# EAGLE design batteryCharger (EAGLE 7.7.0)

## Sheet 1 of 4
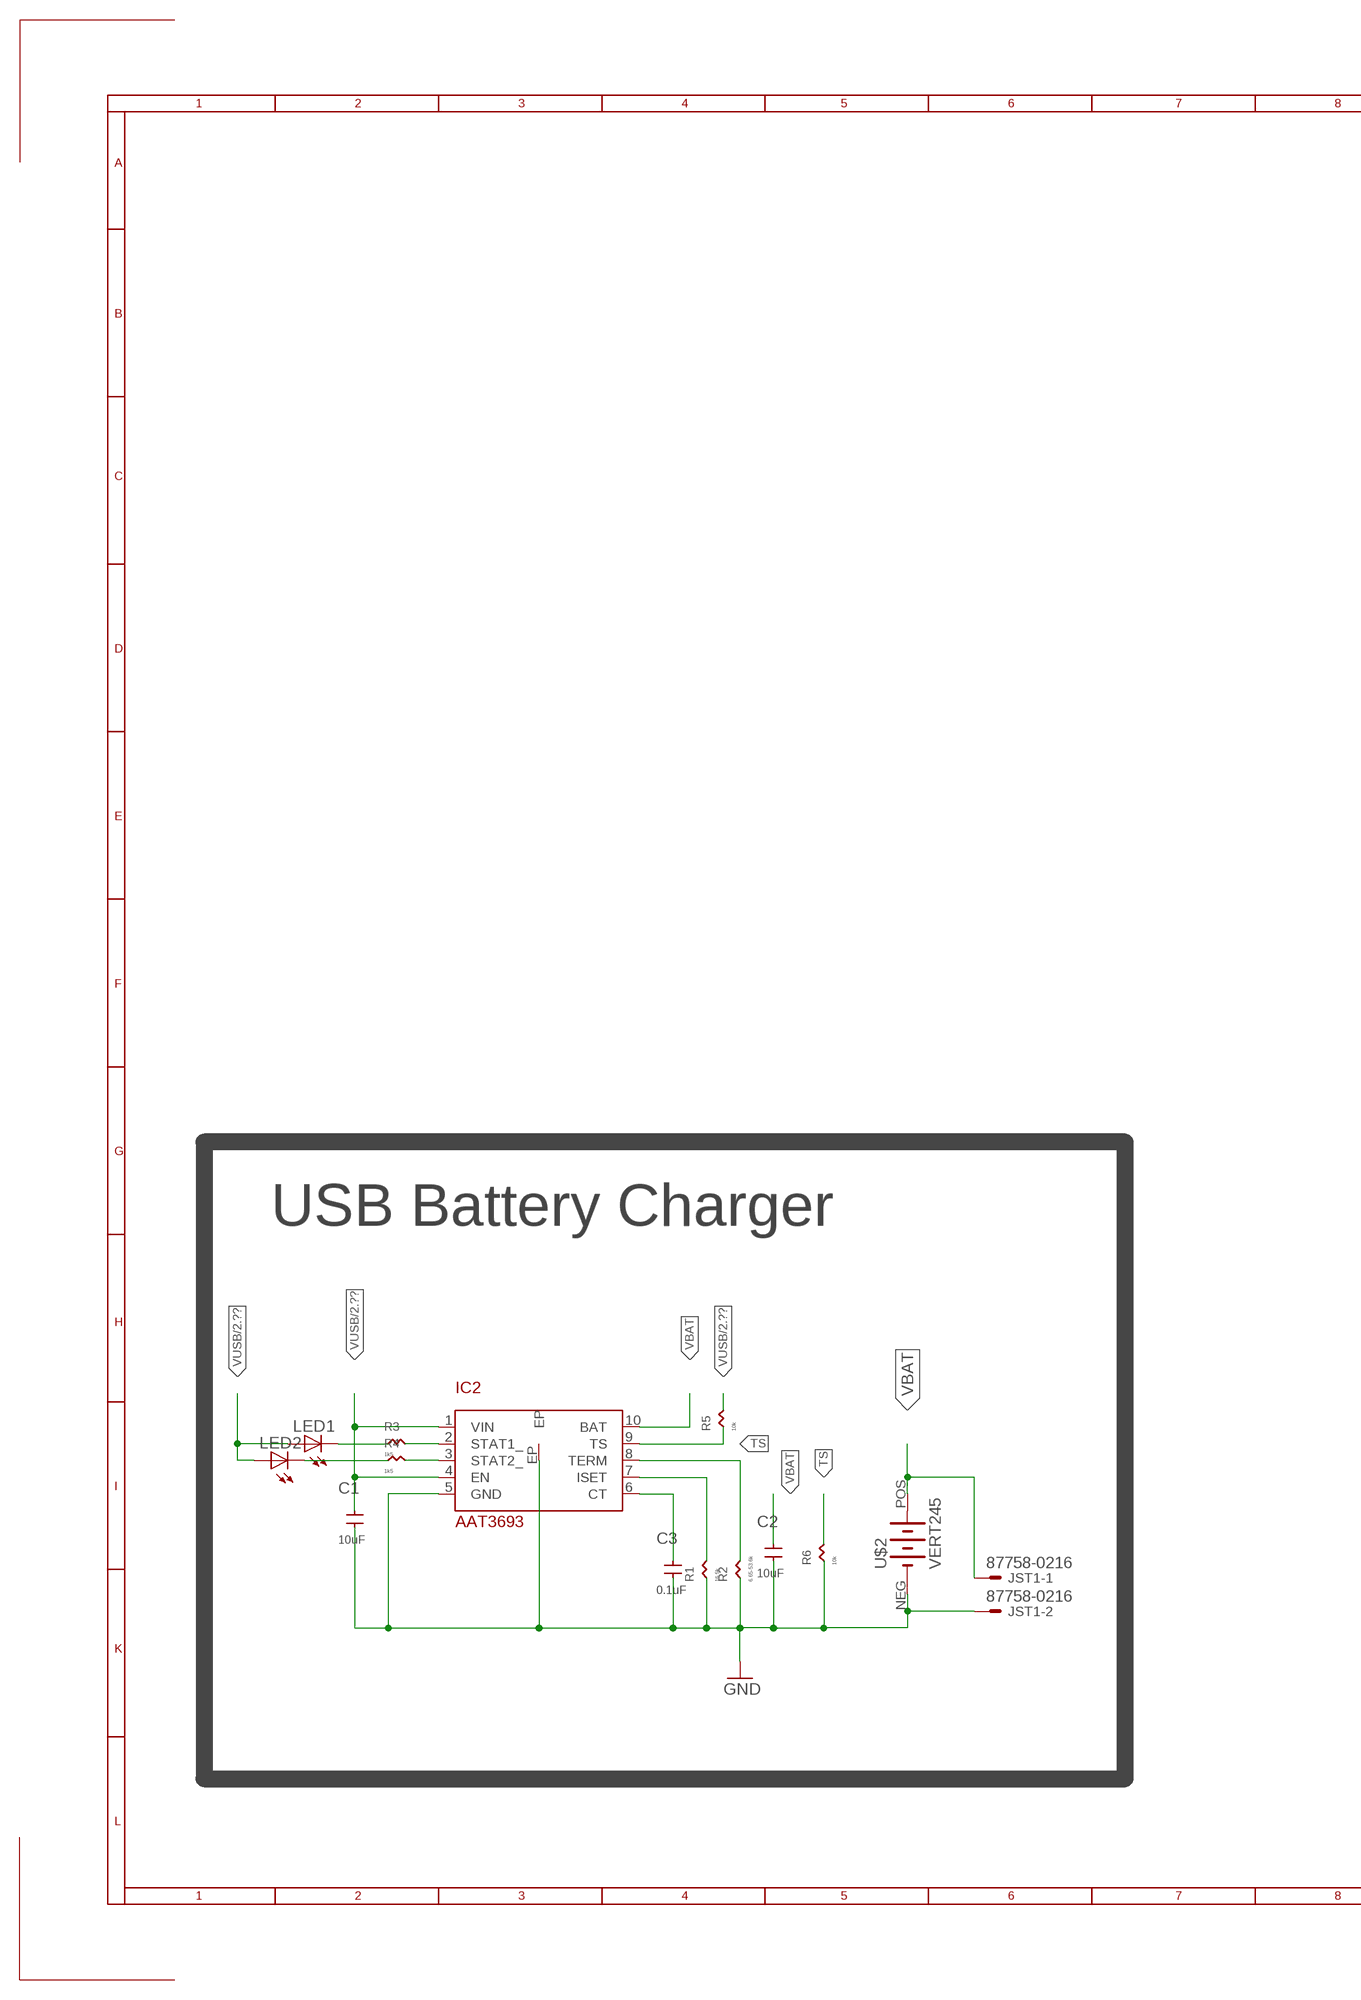
[diagram p0: schematic, sheet 1, part 1 of 2]
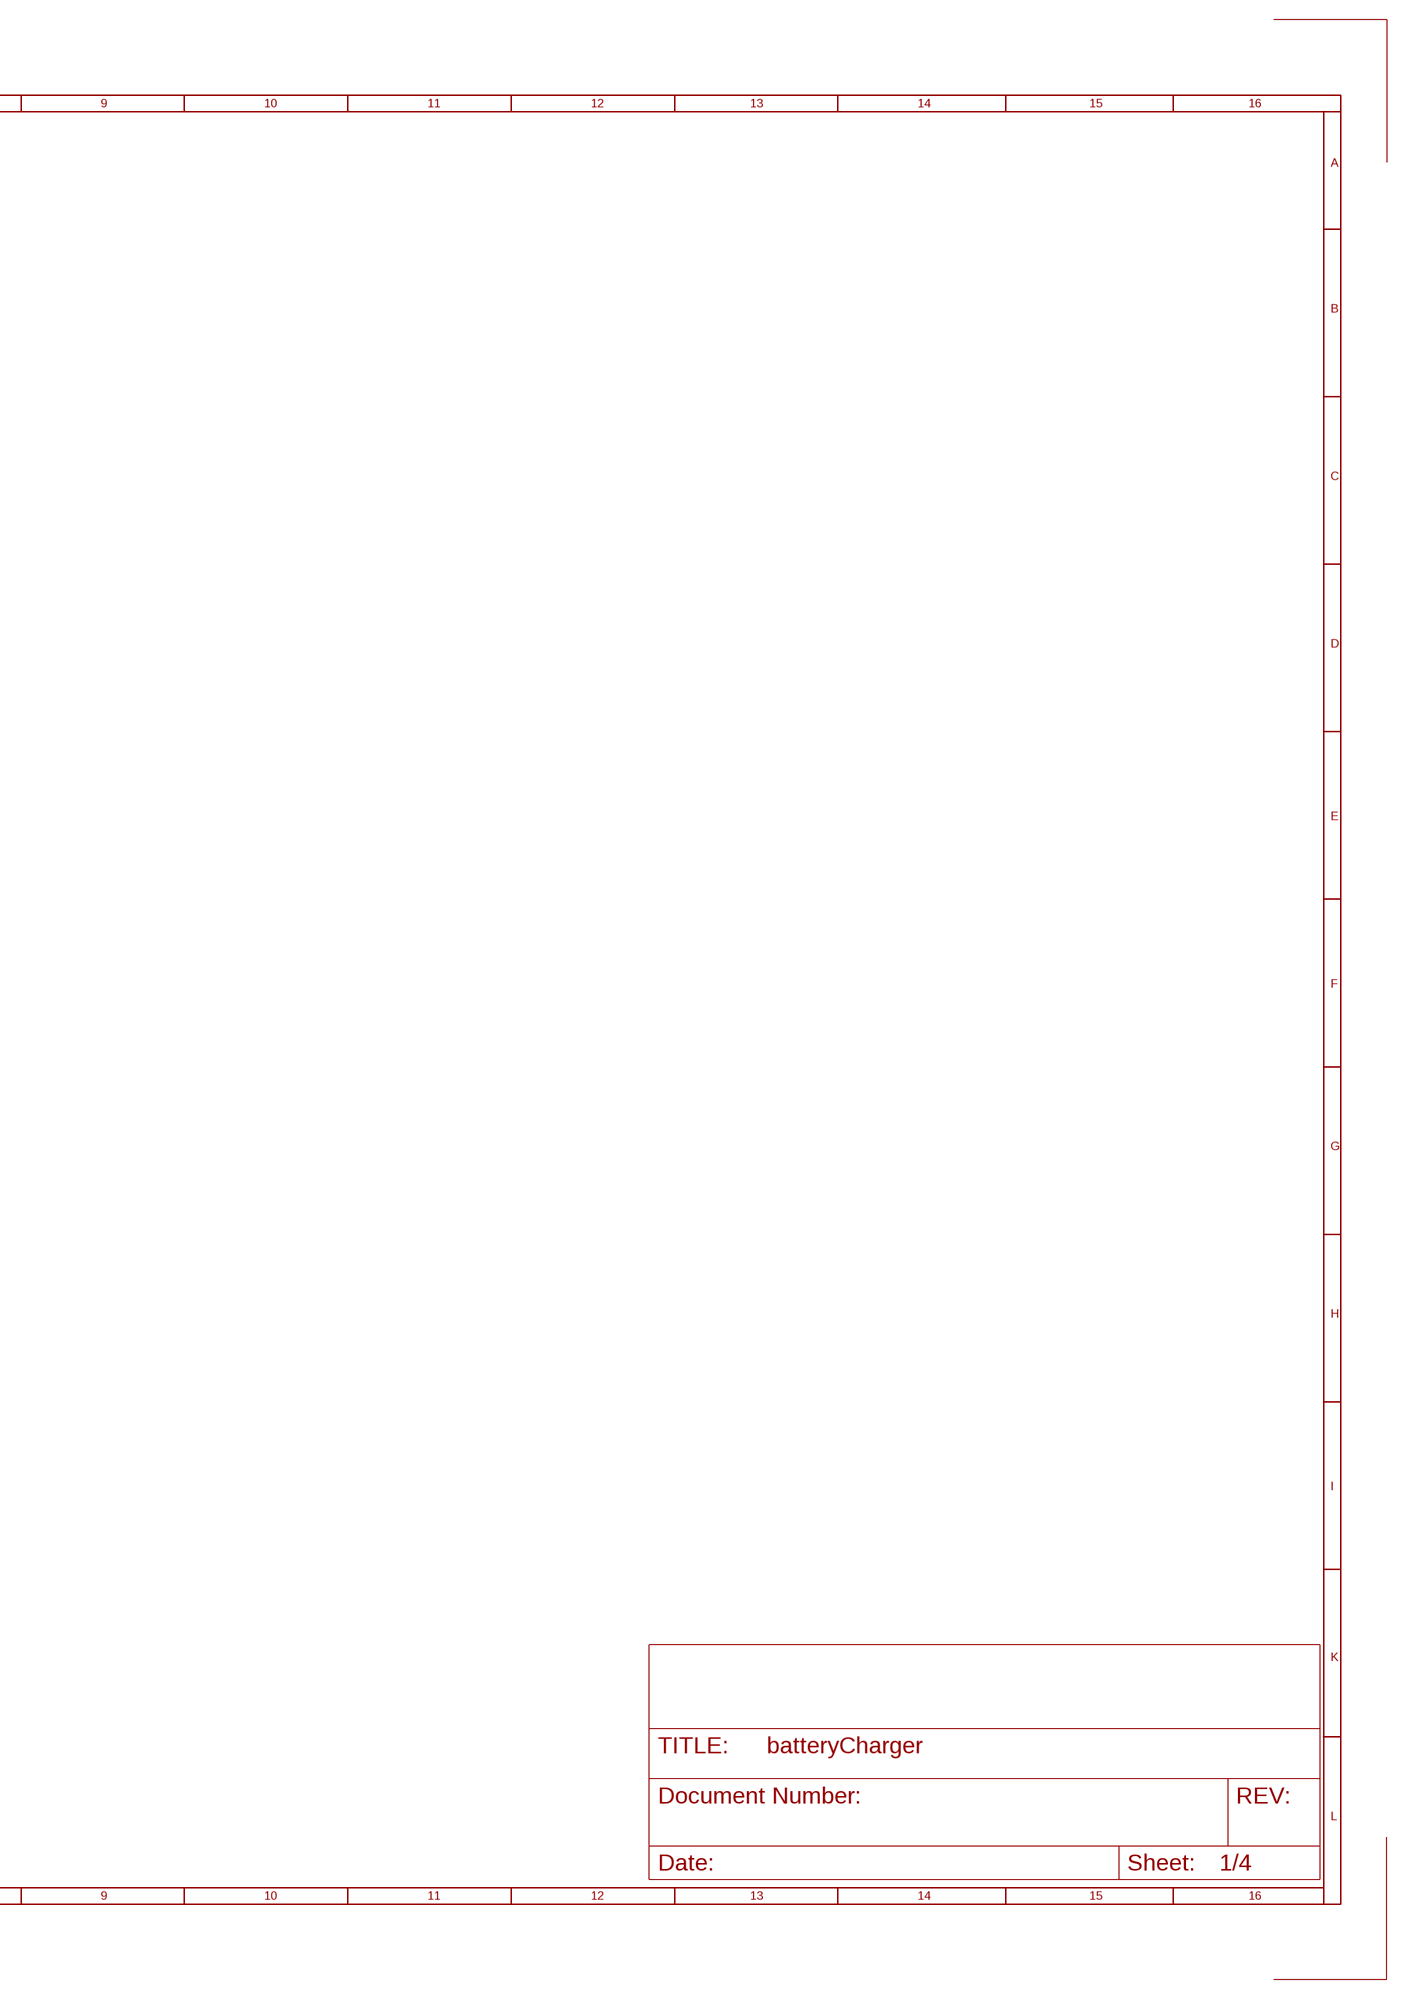
[diagram p1: schematic, sheet 1, part 2 of 2]

### Parts
C1  10uF  C-ER  [C0805]
C2  10uF  C-ER  [C0805]
C3  0.1uF  C-ERC0402  [C0402]
IC2  AAT3693  [AAT3693]
JST1  87758-0216  [87758-0216]
LED1  LEDCHIP-LED0603  [CHIP-LED0603]
LED2  LEDCHIP-LED0603  [CHIP-LED0603]
R1  16.5k  R-ER-TINYR402  [R0402]
R2  6.65-53.6k  R-ER-TINYR402  [R0402]
R3  1k5  R-ER-TINYR402  [R0402]
R4  1k5  R-ER-TINYR402  [R0402]
R5  10k  R-ER-TINYR402  [R0402]
R6  10k  R-ER-TINYR402  [R0402]
U$2  VERT245  [VERT245]

### Nets
GND: C1.1 C2.1 C3.1 IC2.5(GND) IC2.EP JST1.2 R1.1 R2.1 R6.1 U$2.NEG(-) ; also sheet 2,3,4
N$17: C3.2 IC2.6(CT)
N$18: IC2.7(ISET) R1.2
N$19: IC2.8(TERM) R2.2
N$20: IC2.3(STAT2_) R4.2
N$21: IC2.2(STAT1_) R3.2
N$22: LED1.C R3.1
N$23: LED2.C R4.1
TS: IC2.9(TS) R5.1 R6.2
VBAT: C2.2 IC2.10(BAT) JST1.1 U$2.POS(+)
VUSB: C1.2 IC2.1(VIN) IC2.4(EN) LED1.A LED2.A R5.2 ; also sheet 2,3,4

### Notes on the sheet
- USB Battery Charger

## Sheet 2 of 4
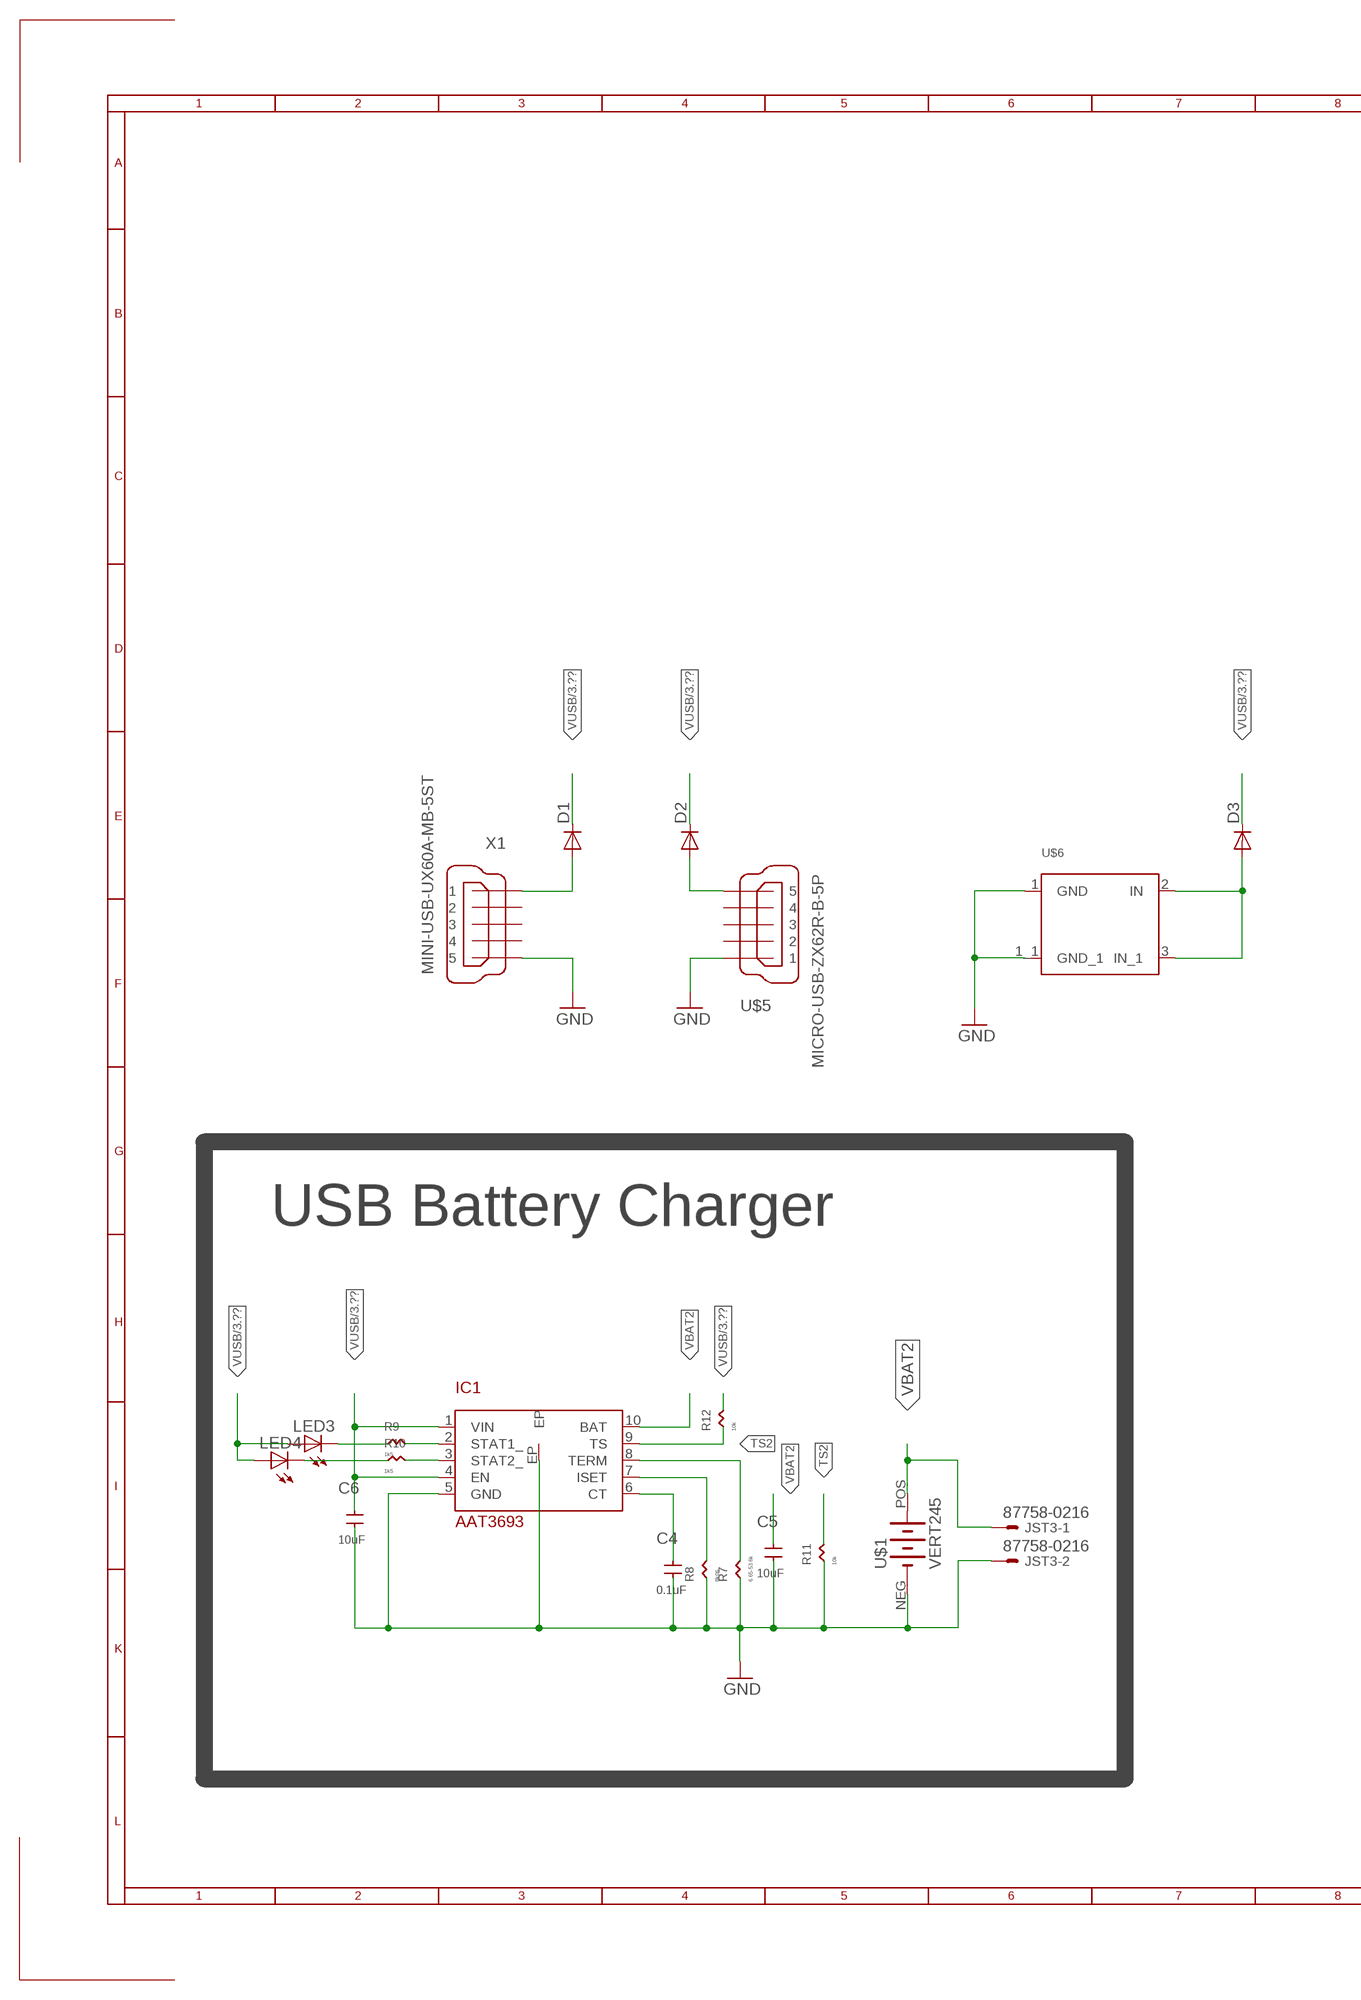
[diagram p2: schematic, sheet 2, part 1 of 2]
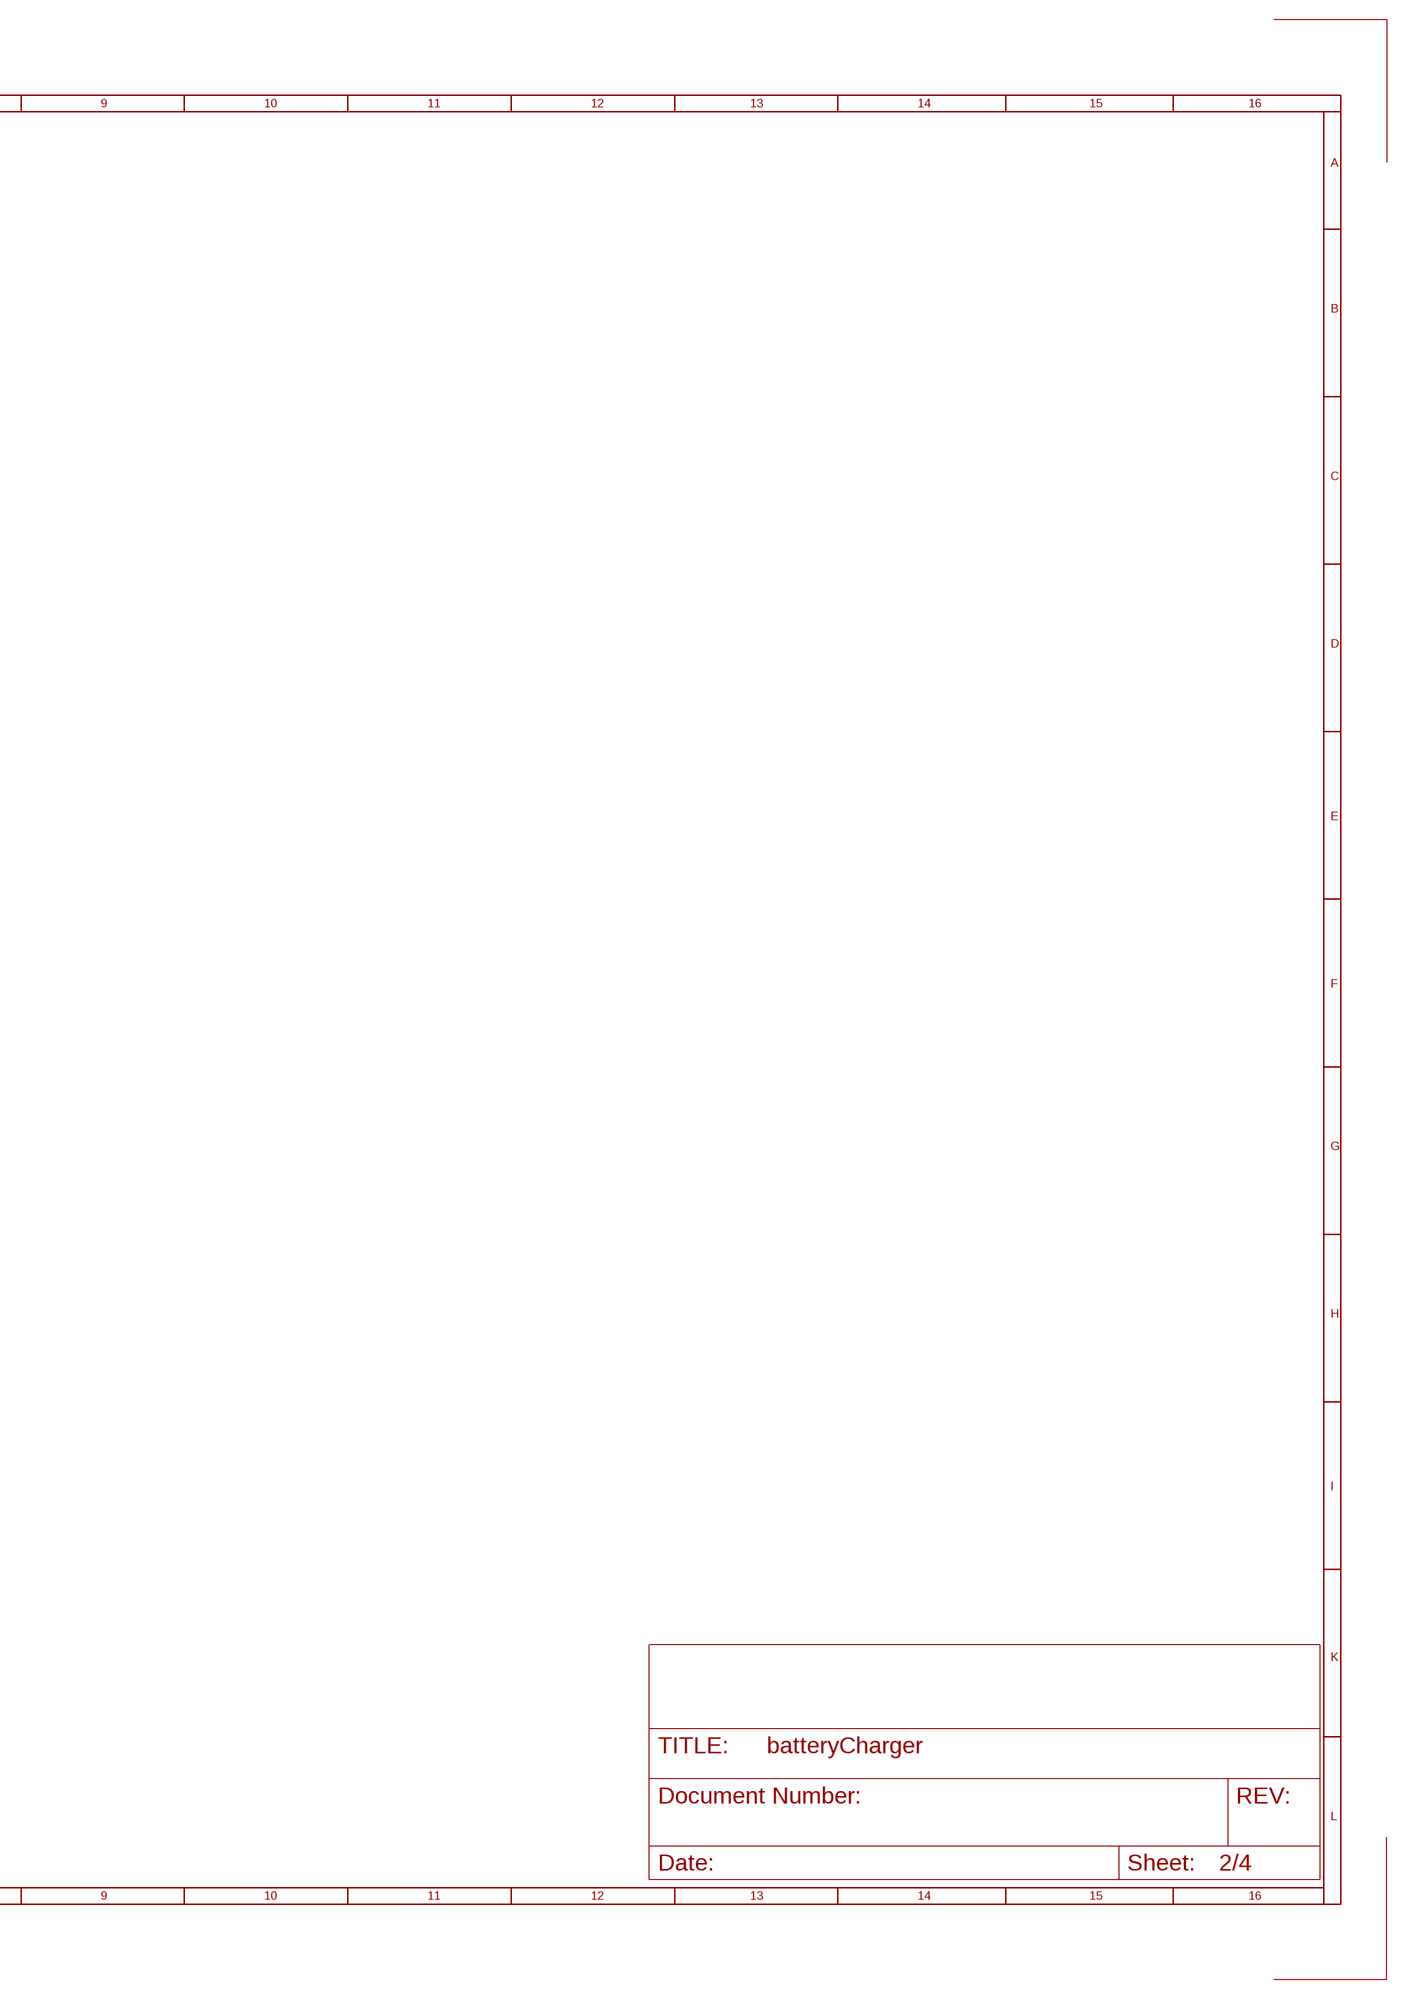
[diagram p3: schematic, sheet 2, part 2 of 2]

### Parts
C4  0.1uF  C-ERC0402  [C0402]
C5  10uF  C-ER  [C0805]
C6  10uF  C-ER  [C0805]
D1  DIODE-SOD323-R  [SOD323-R]
D2  DIODE-SOD323-R  [SOD323-R]
D3  DIODE-SOD323-R  [SOD323-R]
IC1  AAT3693  [AAT3693]
JST3  87758-0216  [87758-0216]
LED3  LEDCHIP-LED0603  [CHIP-LED0603]
LED4  LEDCHIP-LED0603  [CHIP-LED0603]
R7  6.65-53.6k  R-ER-TINYR402  [R0402]
R8  8k06  R-ER-TINYR402  [R0402]
R9  1k5  R-ER-TINYR402  [R0402]
R10  1k5  R-ER-TINYR402  [R0402]
R11  10k  R-ER-TINYR402  [R0402]
R12  10k  R-ER-TINYR402  [R0402]
U$1  VERT245  [VERT245]
U$5  MICRO-USB-ZX62R-B-5P  [ZX62R-B-5P]
U$6  PJ-002A_SMT  [PJ-002A_SMT]
X1  MINI-USB-UX60A-MB-5ST  [UX60A-MB-5ST]

### Nets
GND: C4.1 C5.1 C6.1 IC1.5(GND) IC1.EP JST3.2 R7.1 R8.1 R11.1 U$1.NEG(-) U$5.1 U$6.1(GND) U$6.1_1(GND_1) X1.5 ; also sheet 1,3,4
N$1: C4.2 IC1.6(CT)
N$2: IC1.7(ISET) R8.2
N$3: IC1.8(TERM) R7.2
N$4: IC1.3(STAT2_) R10.2
N$5: IC1.2(STAT1_) R9.2
N$6: LED3.C R9.1
N$7: LED4.C R10.1
N$29: D1.A X1.1
N$31: D2.A U$5.5
N$32: D3.A U$6.2(IN) U$6.3(IN_1)
TS2: IC1.9(TS) R11.2 R12.1
VBAT2: C5.2 IC1.10(BAT) JST3.1 U$1.POS(+)
VUSB: C6.2 D1.C D2.C D3.C IC1.1(VIN) IC1.4(EN) LED3.A LED4.A R12.2 ; also sheet 1,3,4
Unconnected: U$5.2 U$5.3 U$5.4 U$6.NC U$6.NC_1 X1.2 X1.3 X1.4

### Notes on the sheet
- USB Battery Charger

## Sheet 3 of 4
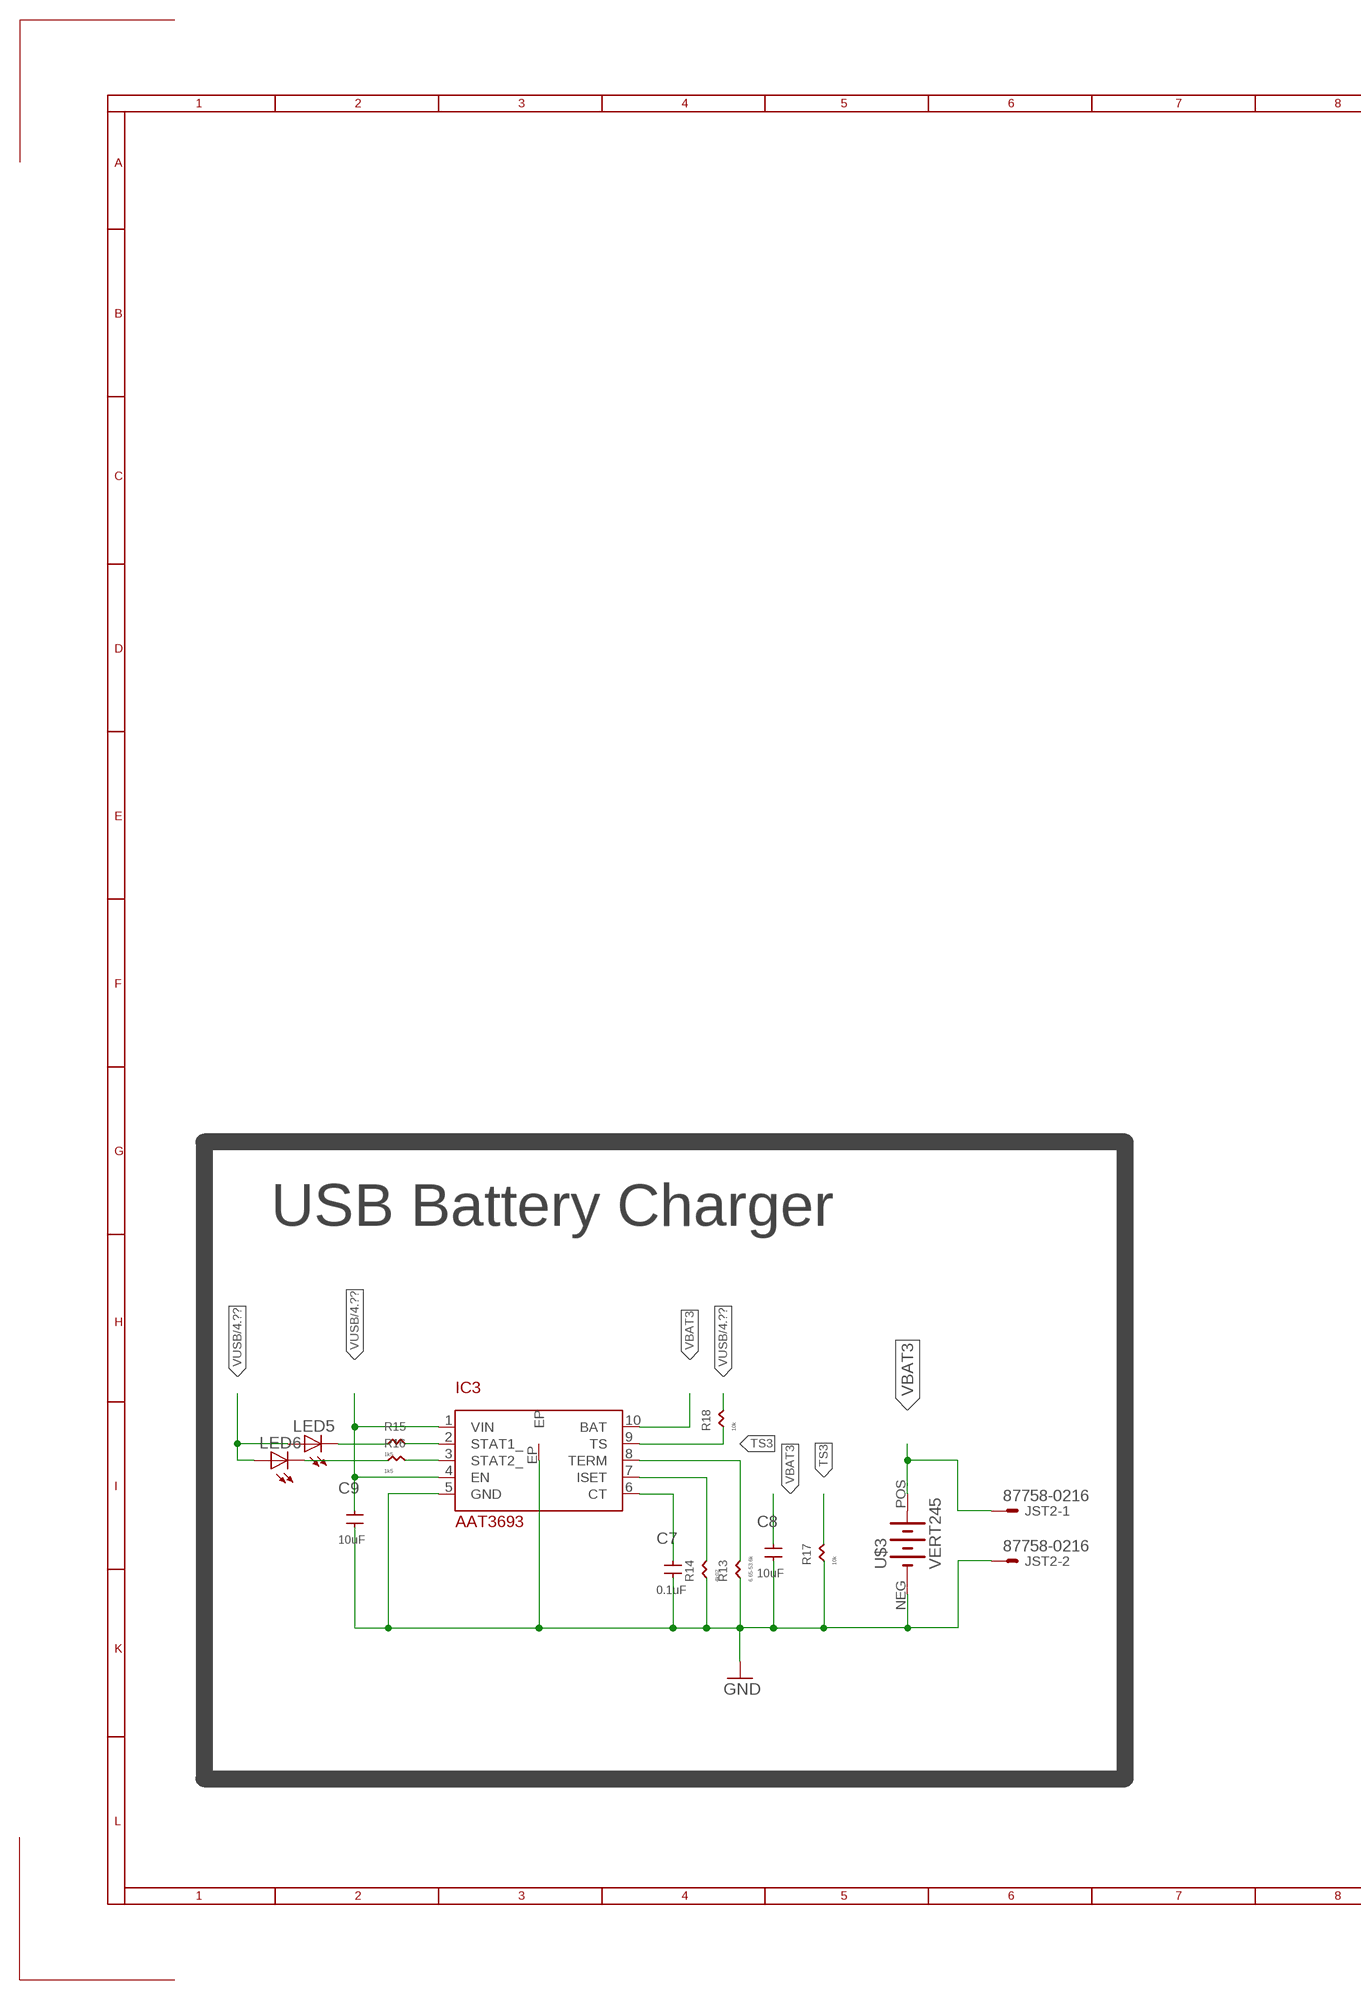
[diagram p4: schematic, sheet 3, part 1 of 2]
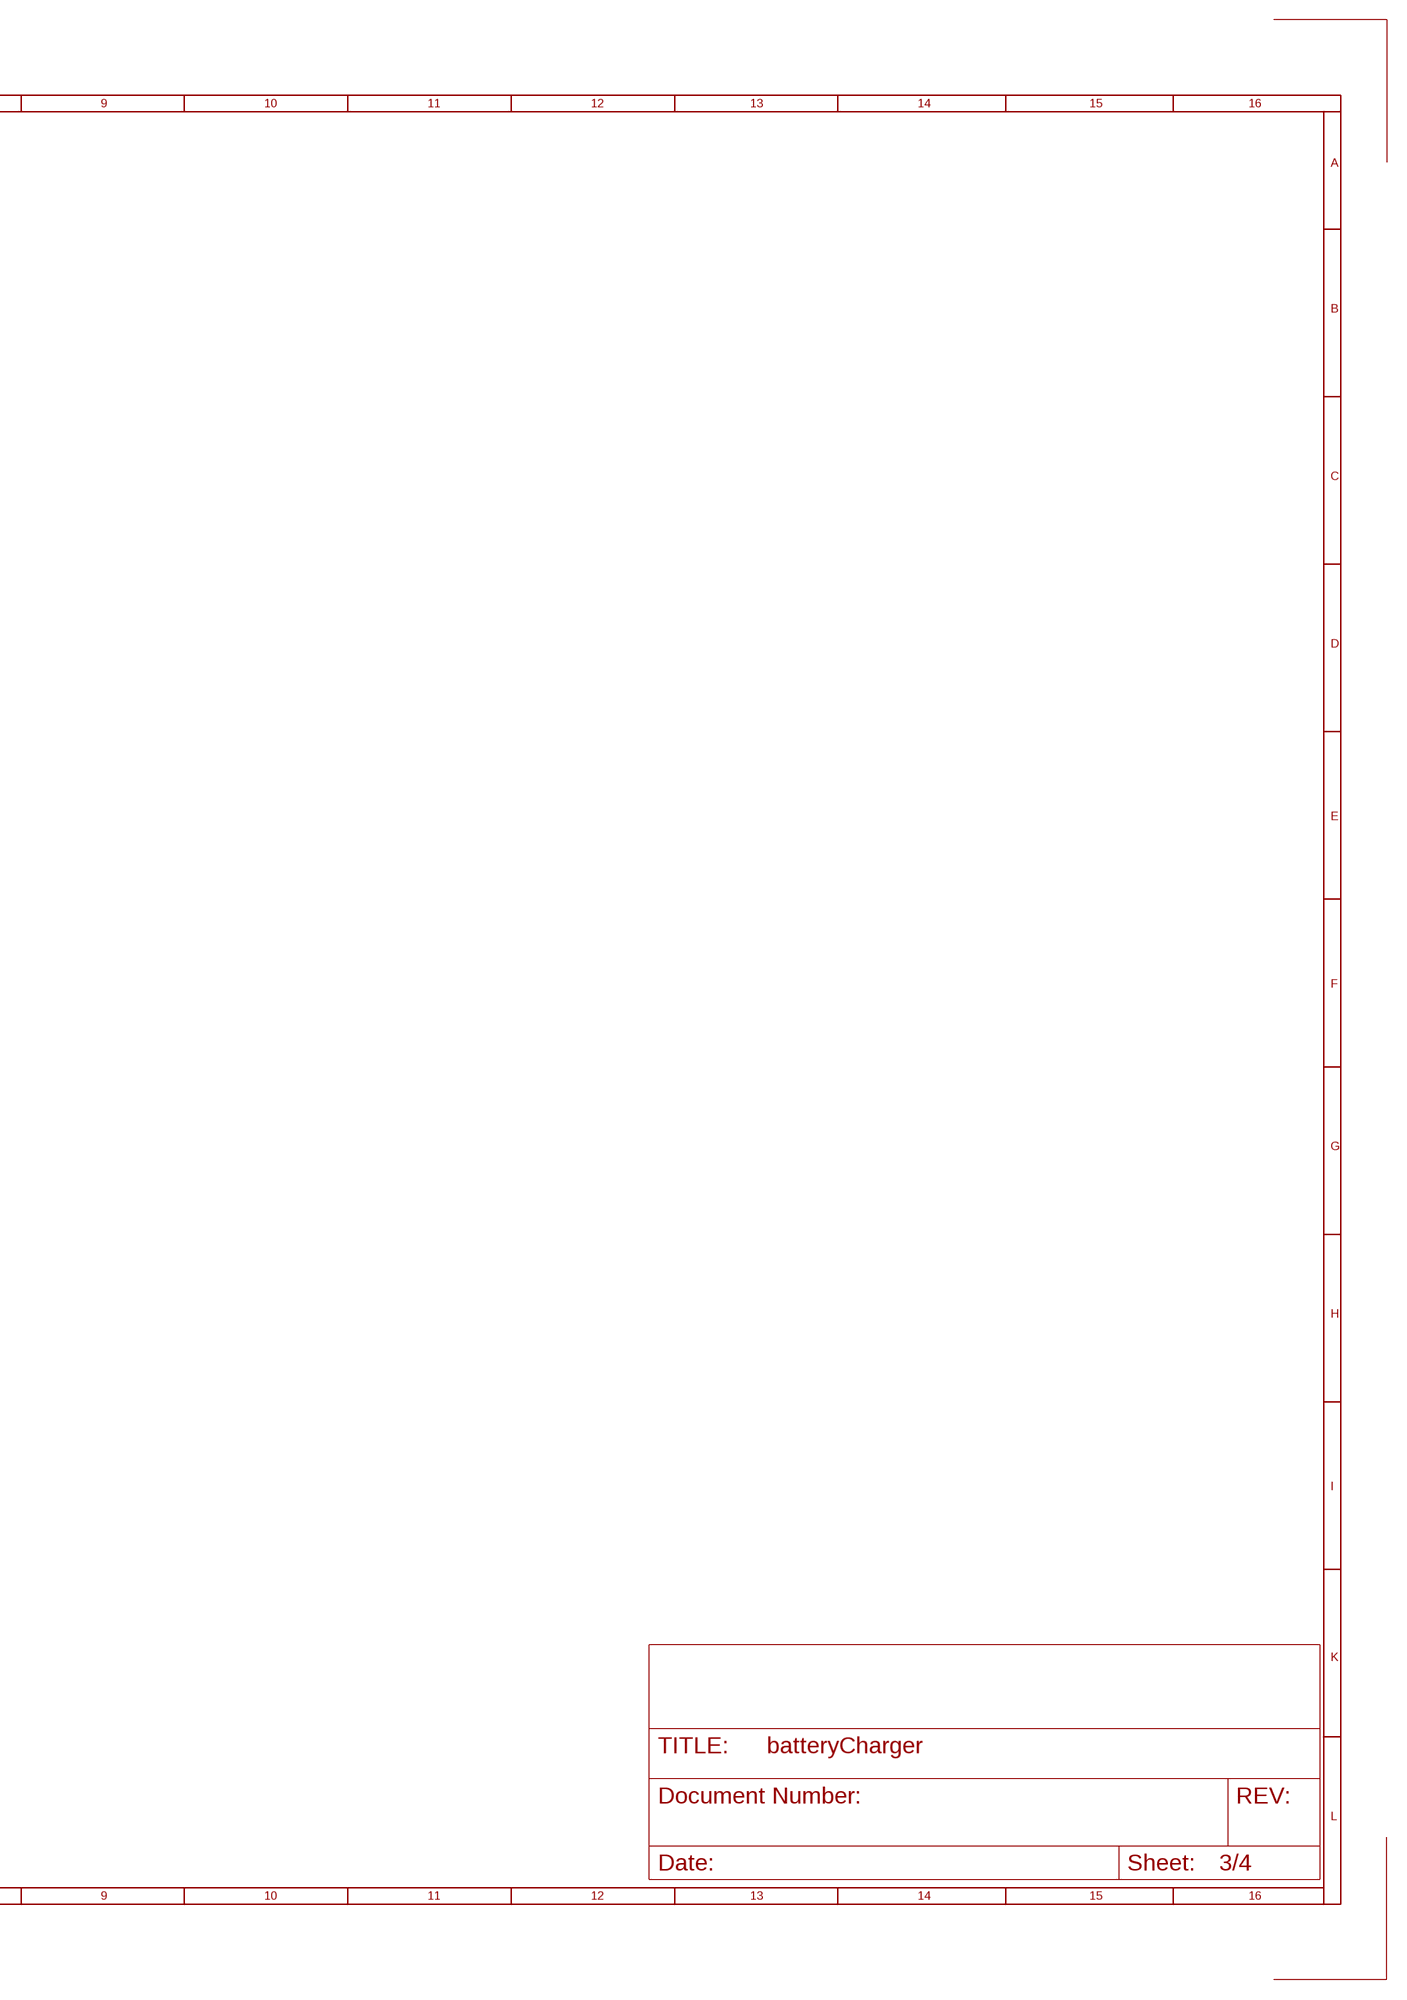
[diagram p5: schematic, sheet 3, part 2 of 2]

### Parts
C7  0.1uF  C-ERC0402  [C0402]
C8  10uF  C-ER  [C0805]
C9  10uF  C-ER  [C0805]
IC3  AAT3693  [AAT3693]
JST2  87758-0216  [87758-0216]
LED5  LEDCHIP-LED0603  [CHIP-LED0603]
LED6  LEDCHIP-LED0603  [CHIP-LED0603]
R13  6.65-53.6k  R-ER-TINYR402  [R0402]
R14  4k02  R-ER-TINYR402  [R0402]
R15  1k5  R-ER-TINYR402  [R0402]
R16  1k5  R-ER-TINYR402  [R0402]
R17  10k  R-ER-TINYR402  [R0402]
R18  10k  R-ER-TINYR402  [R0402]
U$3  VERT245  [VERT245]

### Nets
GND: C7.1 C8.1 C9.1 IC3.5(GND) IC3.EP JST2.2 R13.1 R14.1 R17.1 U$3.NEG(-) ; also sheet 1,2,4
N$8: C7.2 IC3.6(CT)
N$9: IC3.7(ISET) R14.2
N$10: IC3.8(TERM) R13.2
N$11: IC3.3(STAT2_) R16.2
N$12: IC3.2(STAT1_) R15.2
N$13: LED5.C R15.1
N$14: LED6.C R16.1
TS3: IC3.9(TS) R17.2 R18.1
VBAT3: C8.2 IC3.10(BAT) JST2.1 U$3.POS(+)
VUSB: C9.2 IC3.1(VIN) IC3.4(EN) LED5.A LED6.A R18.2 ; also sheet 1,2,4

### Notes on the sheet
- USB Battery Charger

## Sheet 4 of 4
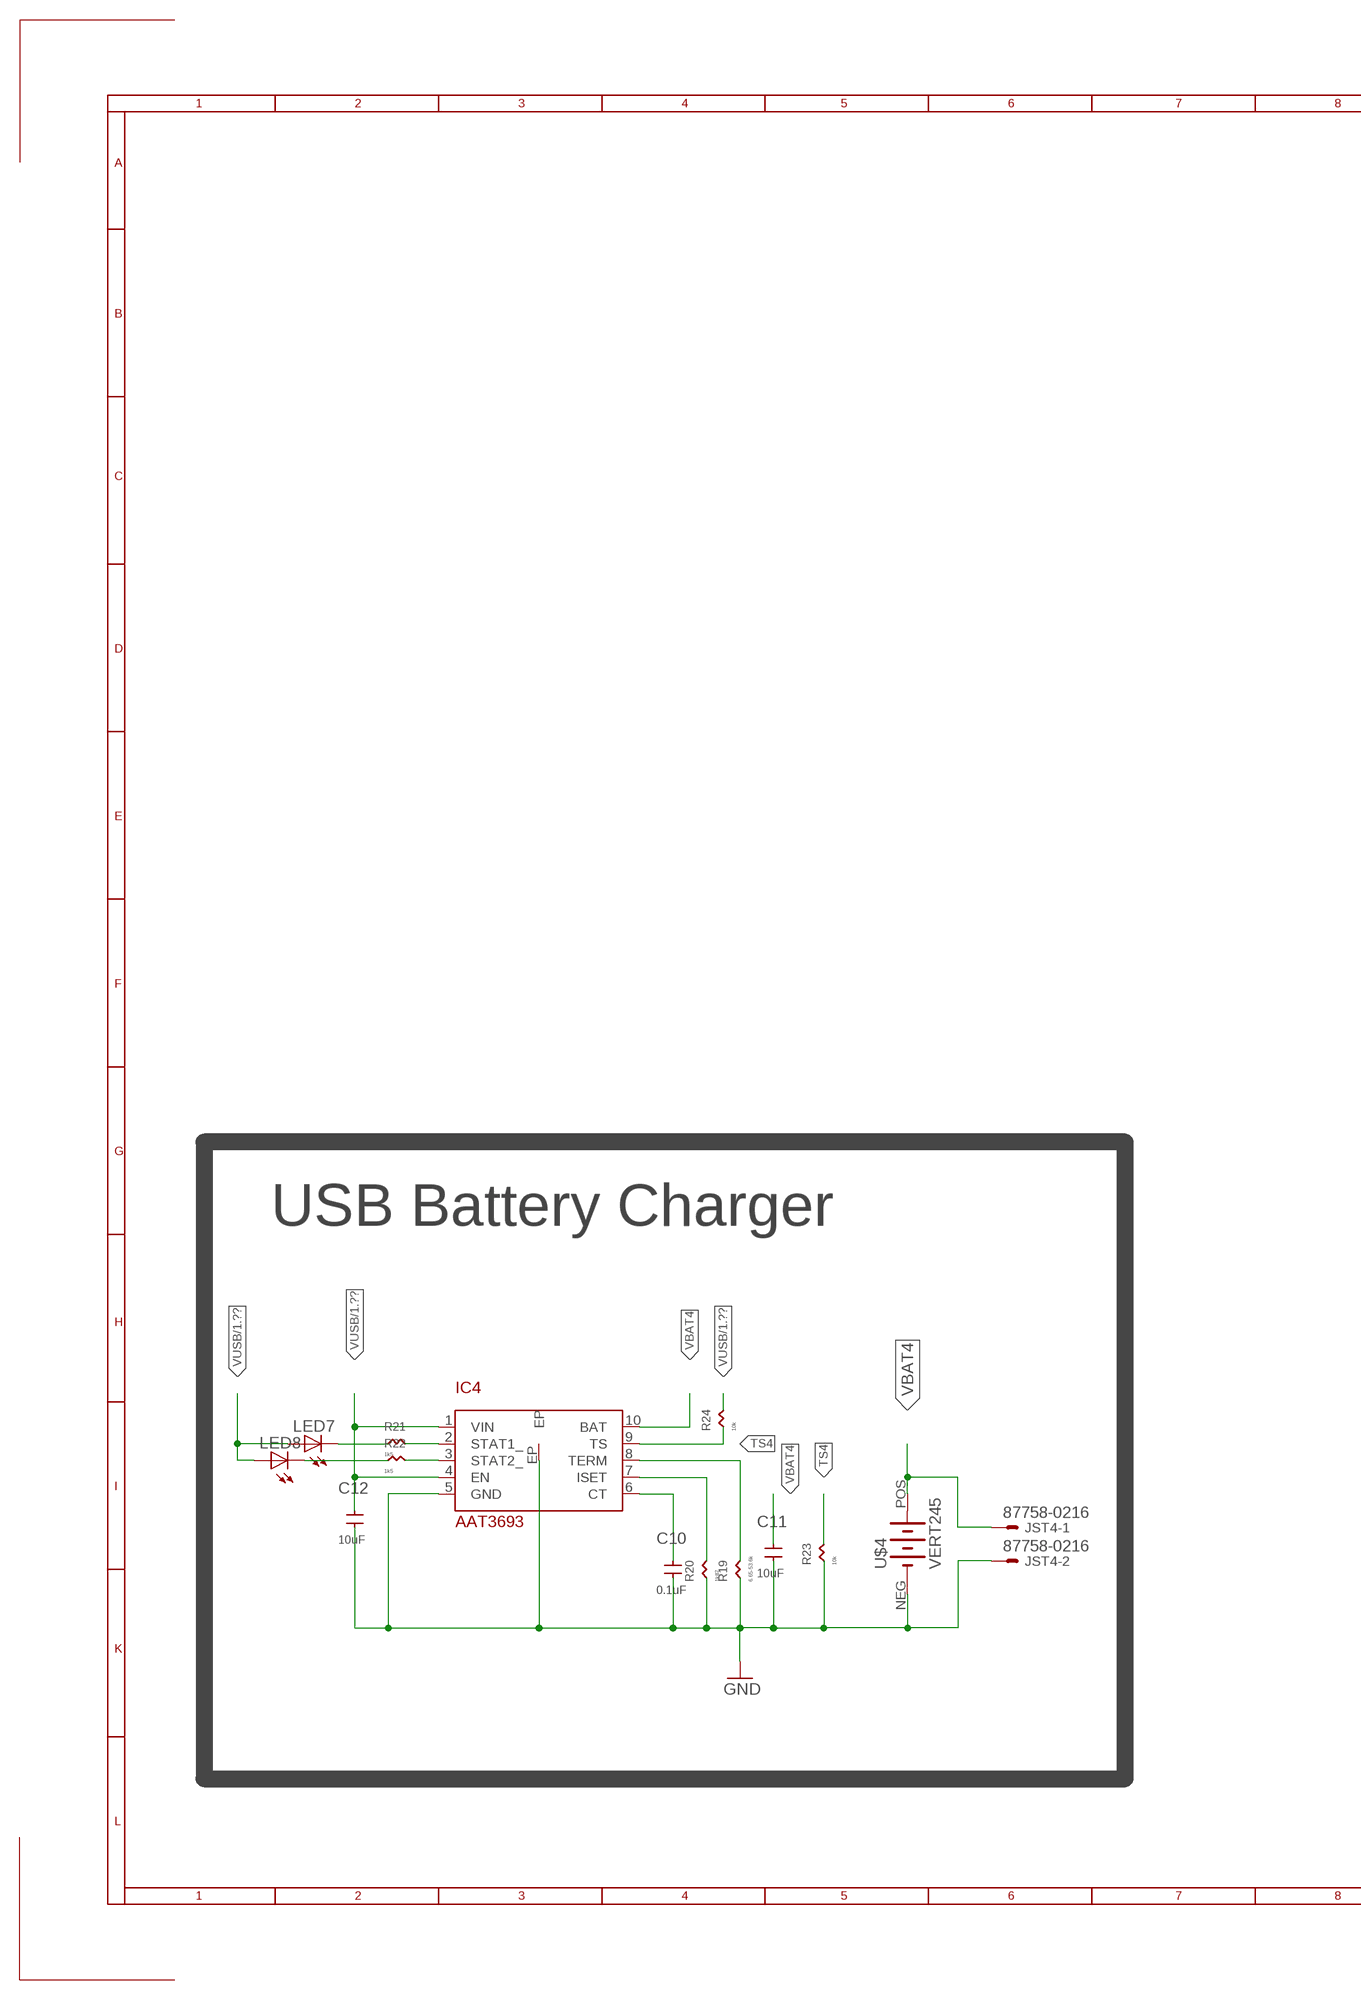
[diagram p6: schematic, sheet 4, part 1 of 2]
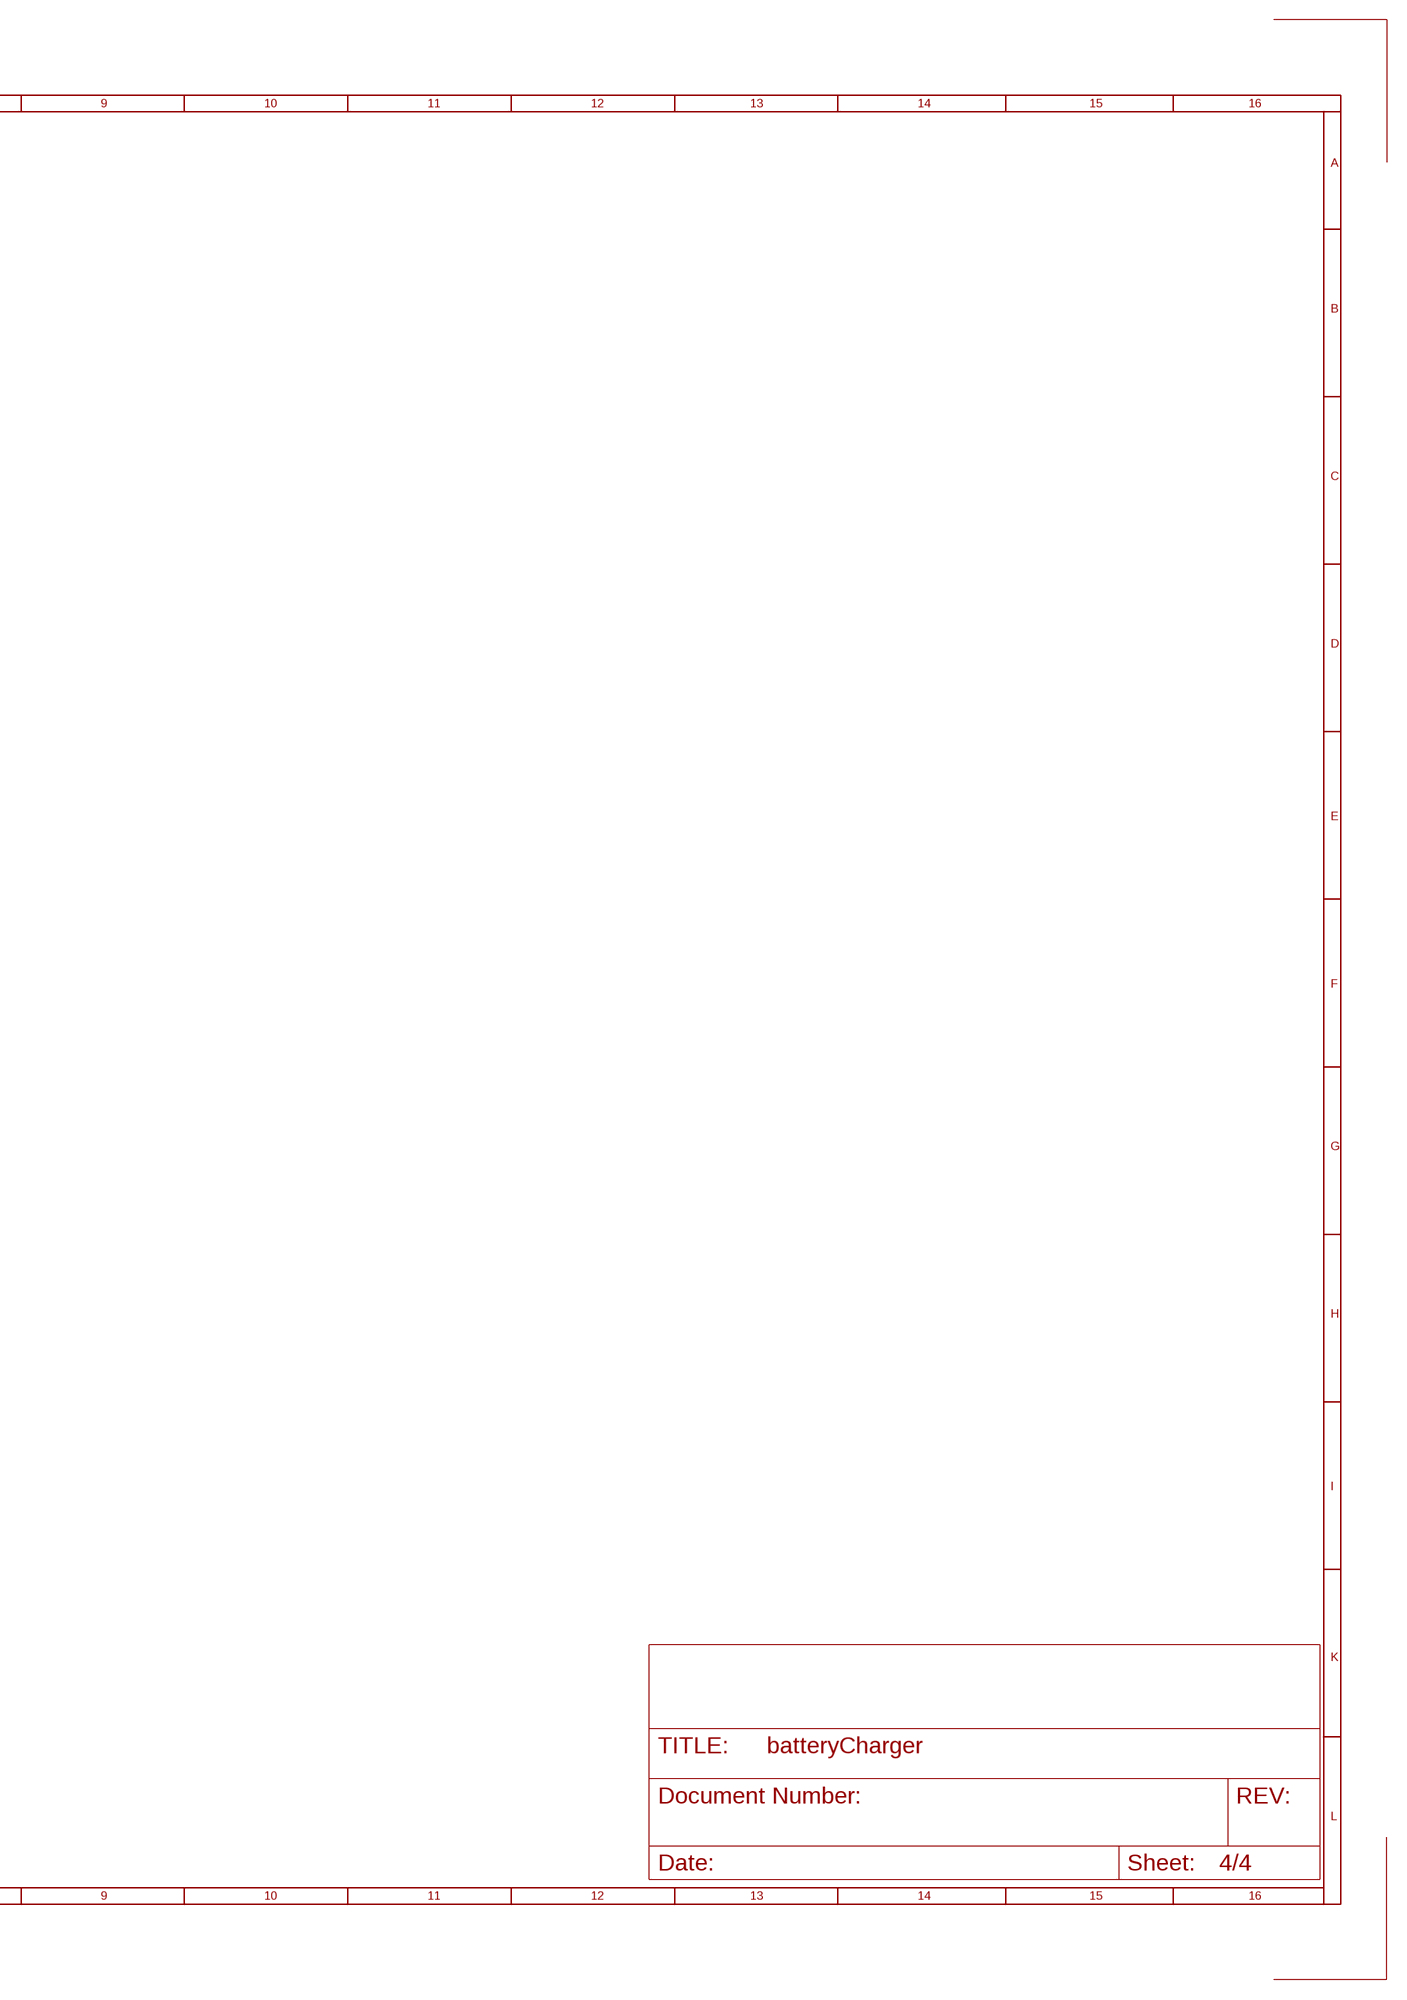
[diagram p7: schematic, sheet 4, part 2 of 2]

### Parts
C10  0.1uF  C-ERC0402  [C0402]
C11  10uF  C-ER  [C0805]
C12  10uF  C-ER  [C0805]
IC4  AAT3693  [AAT3693]
JST4  87758-0216  [87758-0216]
LED7  LEDCHIP-LED0603  [CHIP-LED0603]
LED8  LEDCHIP-LED0603  [CHIP-LED0603]
R19  6.65-53.6k  R-ER-TINYR402  [R0402]
R20  1k87  R-ER-TINYR402  [R0402]
R21  1k5  R-ER-TINYR402  [R0402]
R22  1k5  R-ER-TINYR402  [R0402]
R23  10k  R-ER-TINYR402  [R0402]
R24  10k  R-ER-TINYR402  [R0402]
U$4  VERT245  [VERT245]

### Nets
GND: C10.1 C11.1 C12.1 IC4.5(GND) IC4.EP JST4.2 R19.1 R20.1 R23.1 U$4.NEG(-) ; also sheet 1,2,3
N$15: C10.2 IC4.6(CT)
N$16: IC4.7(ISET) R20.2
N$24: IC4.8(TERM) R19.2
N$25: IC4.3(STAT2_) R22.2
N$26: IC4.2(STAT1_) R21.2
N$27: LED7.C R21.1
N$28: LED8.C R22.1
TS4: IC4.9(TS) R23.2 R24.1
VBAT4: C11.2 IC4.10(BAT) JST4.1 U$4.POS(+)
VUSB: C12.2 IC4.1(VIN) IC4.4(EN) LED7.A LED8.A R24.2 ; also sheet 1,2,3

### Notes on the sheet
- USB Battery Charger

## Library data of the parts
C1-C12 = rcl:C-ER
D1-D3 = diode:DIODE-: DIODE; DIGIKEY: BAT60AE6327HTSA1CT-ND
IC1-IC4 = skyworks:AAT3693
JST1-JST4 = con-molex:87758-0216: 2 Pin - 2mm Dual Row Single Wafer, Vertical T/H HDR Source: http://www.molex.com/pdm_docs/sd/877580616_sd.pdf
LED1-LED8 = led:LED: LED OSRAM: - CHIPLED LG R971, LG N971, LY N971, LG Q971, LY Q971, LO R971, LY R971 LH N974, LH R974 LS Q976, LO Q976, LY Q976 LO Q996 - Hyper CHIPLED LW Q18S LB Q993, LB Q99A, LB R99A - SideLED LS A670, LO A670, LY A670, LG A670, LP A670 LB A673, LV A673, LT A673, LW A673 LH A674 LY A675 LS A676, LA A676, LO A676, LY A676, LW A676 LS A679, LY A679, LG A679 - Hyper Micro SIDELED® LS Y876, LA Y876, LO Y876, LY Y876 LT Y87S - SmartLED LW L88C, LW L88S LB L89C, LB L89S, LG L890 LS L89K, LO L89K, LY L89K LS L896, LA L896, LO L896, LY L896 - TOPLED LS T670, LO T670, LY T670, LG T670, LP T670 LSG T670, LSP T670, LSY T670, LOP T670, LYG T670 LG T671, LOG T671, LSG T671 LB T673, LV T673, LT T673, LW T673 LH T674 LS T676, LA T676, LO T676, LY T676, LB T676, LH T676, LSB T676, LW T676 LB T67C, LV T67C, LT T67C, LS T67K, LO T67K, LY T67K, LW E67C LS E67B, LA E67B, LO E67B, LY E67B, LB E67C, LV E67C, LT E67C LW T67C LS T679, LY T679, LG T679 LS T770, LO T770, LY T770, LG T770, LP T770 LB T773, LV T773, LT T773, LW T773 LH T774 LS E675, LA E675, LY E675, LS T675 LS T776, LA T776, LO T776, LY T776, LB T776 LHGB T686 LT T68C, LB T68C - Hyper Mini TOPLED® LB M676 - Mini TOPLED Santana® LG M470 LS M47K, LO M47K, LY M47K Source: http://www.osram.convergy.de LUXEON: - LUMILED® LXK2-PW12-R00, LXK2-PW12-S00, LXK2-PW14-U00, LXK2-PW14-V00 LXK2-PM12-R00, LXK2-PM12-S00, LXK2-PM14-U00 LXK2-PE12-Q00, LXK2-PE12-R00, LXK2-PE12-S00, LXK2-PE14-T00, LXK2-PE14-U00 LXK2-PB12-K00, LXK2-PB12-L00, LXK2-PB12-M00, LXK2-PB14-N00, LXK2-PB14-P00, LXK2-PB14-Q00 LXK2-PR12-L00, LXK2-PR12-M00, LXK2-PR14-Q00, LXK2-PR14-R00 LXK2-PD12-Q00, LXK2-PD12-R00, LXK2-PD12-S00 LXK2-PH12-R00, LXK2-PH12-S00 LXK2-PL12-P00, LXK2-PL12-Q00, LXK2-PL12-R00 Source: www.luxeon.com KINGBRIGHT: KA-3528ASYC Source: www.kingbright.com
R1-R24 = rcl:R-ER-TINY
U$1-U$4 = battery:VERT245
U$5 = con-hirose:MICRO-USB-: Hirose Micro USB Connector ZX62R-B-5P: Micro B, reverse (top mount) shell SMT Supplier: DigiKey H11574CT-ND Source: http://www.hirose.co.jp/cataloge_hp/e24200011.pdf
U$6 = power_connector:PJ-002A_SMT
X1 = con-hirose:MINI-USB-: Hirose MINI USB Connector UX60-MB-5S8: Through-hole / SMT Supplier: UX60-MB-5ST: Through-hole / SMT Supplier: UX60A-MB-5ST: Through-hole / SMT Supplier: Source: http://www.hirose.co.jp/cataloge_hp/e24000019.pdf

## Board
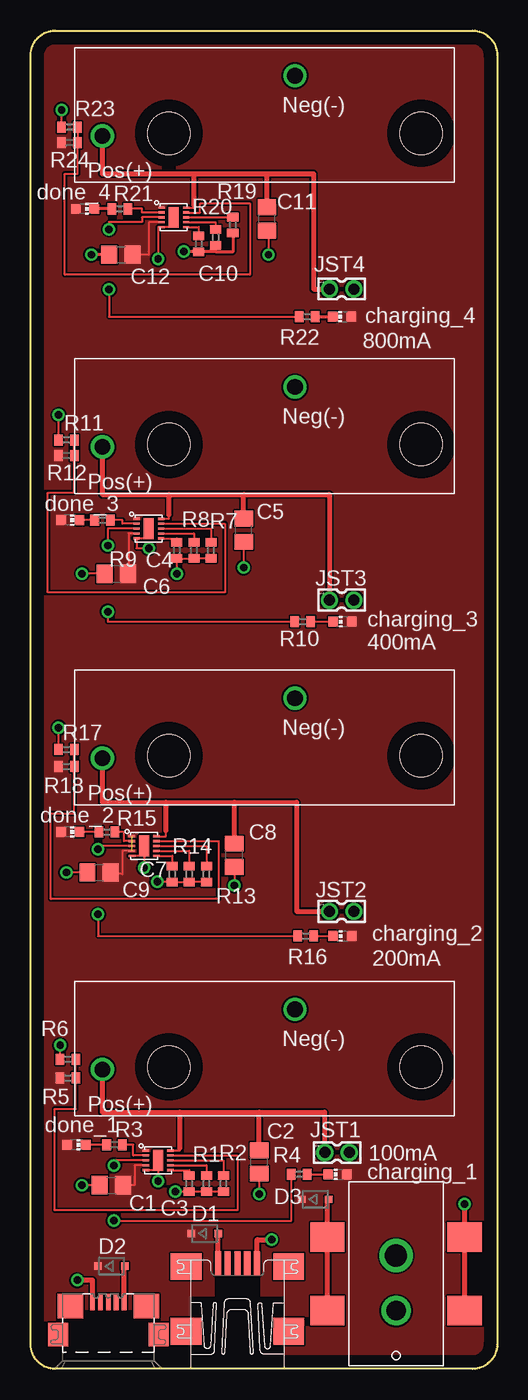
[diagram p8: board, top side]
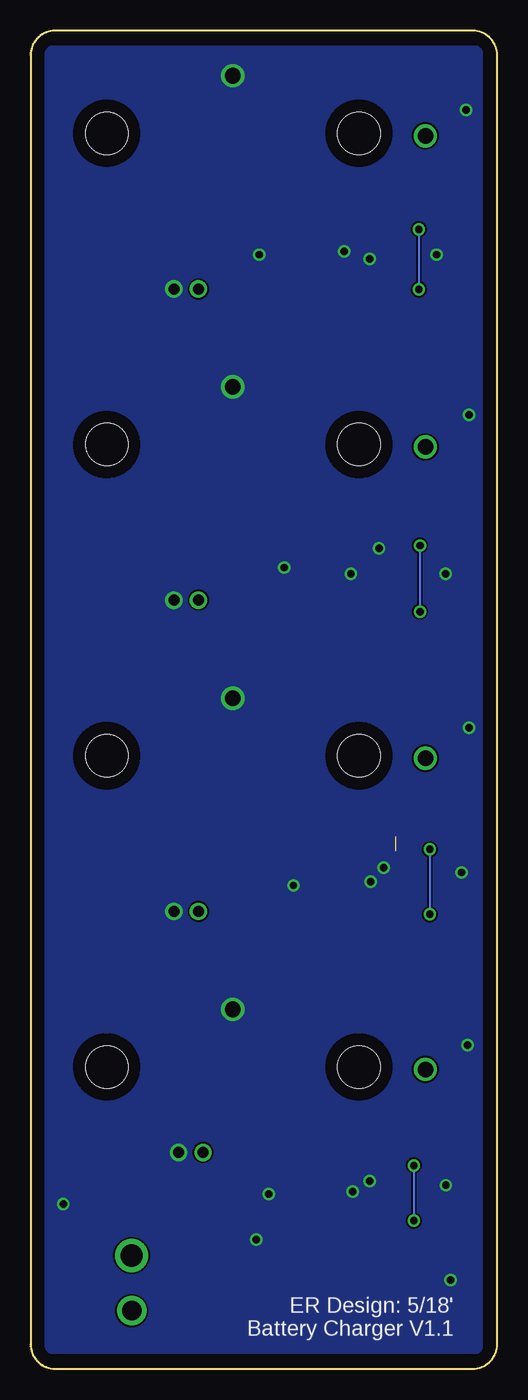
[diagram p9: board, bottom side, seen from below]

Size 38.1 x 109.22 mm. Coordinates in mm from the lower left corner, seen from the top.
Outline: 0,2 0,107.22 arc-90 2,109.22 36.1,109.22 arc-90 38.1,107.22 38.1,2 arc-90 36.1,0 2,0 arc-90 0,2
Copper layers (1*16): Top 0.035mm / dielectric 1.5mm / Bottom 0.035mm
Design rules "default *": minimum track width 6mil, minimum drill 20mil, track to track 6mil, track to pad 6mil, pad to pad 6mil, via to via 6mil, smd to smd 6mil, copper to edge 40mil, drill to drill 8mil, minimum pad ring 10mil, minimum via ring 8mil, stop-mask expansion 4mil, vias tented up to drill 0mil, thermal gap 10mil

### Footprints (pad centres in the part's own frame; a part is rotated, then mirrored left to right if it is on the bottom)
C0805 = smd 1.3 x 1.5: 1 -0.95,0; 2 0.95,0
C0402 = smd 0.7 x 0.9: 1 -0.65,0; 2 0.65,0
SOD323-R = smd 0.6 x 0.6: A 1.1,0; C -1.1,0
AAT3693 = smd 0.6 x 0.2: 1 -1,0.8; 2 -1,0.4; 3 -1,0; 4 -1,-0.4; 5 -1,-0.8; 6 1,-0.8; 7 1,-0.4; 8 1,0; 9 1,0.4; 10 1,0.8 | smd 0.9 x 1.7: EP 0,0
87758-0216 = drill 0.9 pad 1.27: 1 0,-1; 2 0,1
CHIP-LED0603 = smd 0.8 x 0.8: A 0,-0.75; C 0,0.75
R0402 = smd 0.7 x 0.9: 1 -0.65,0; 2 0.65,0
VERT245 = drill 1.27: NEG 0,-4.7; POS 15.73,0.2 | hole 3.45: -10.3,0; 10.3,0
ZX62R-B-5P = smd 1.35 x 0.4: 1 2.675,1.3; 2 2.675,0.65; 3 2.675,0; 4 2.675,-0.65; 5 2.675,-1.3 | smd 1.9 x 1.6: M1 0,-4.1; M2 0,4.1 | smd 2 x 2.1: M3 2.35,3.1; M4 2.35,-3.1
PJ-002A_SMT = smd 2.4 x 2.8: 1 -3,-5.6; 1_1 3,-5.6; 2 -3,5.6; 3 3,5.6 | drill 1.6: NC -3,0 | drill 1.8: NC_1 1.5,0
UX60A-MB-5ST = smd 2 x 0.5: 1 2.25,1.6; 2 2.25,0.8; 3 2.25,0; 4 2.25,-0.8; 5 2.25,-1.6 | smd 2.2 x 2.5: M1 -3.3,-4.2; M2 -3.3,4.2; M3 2,4.2; M4 2,-4.2

### Placement (x,y rotation side)
C1  6.6,14.99 0 top
C2  18.67,16.89 90 top
C3  12.95,15.11 90 top
C4  11.94,66.8 90 top
C5  17.4,68.45 90 top
C6  7.01,64.89 0 top
C7  11.56,40.39 90 top
C8  16.64,41.91 90 top
C9  5.59,40.51 0 top
C10  13.72,91.82 90 top
C11  19.3,93.85 90 top
C12  7.37,90.93 0 top
D1  14.22,11.05 0 top
D2  6.6,8.38 0 top
D3  23.24,13.84 0 top
IC1  9.65,68.58 0 top
IC2  10.41,17.02 0 top
IC3  9.27,42.67 0 top
IC4  11.68,93.98 0 top
JST1  25.02,17.65 270 top
JST2  25.4,37.34 270 top
JST3  25.4,62.74 270 top
JST4  25.4,88.14 270 top
LED1  3.75,18.29 270 top
LED2  25.05,15.88 90 top
LED3  3.24,69.27 270 top
LED4  25.46,60.98 90 top
LED5  3.24,43.81 270 top
LED6  25.46,35.33 90 top
LED7  4.44,94.67 270 top
LED8  25.43,85.87 90 top
R1  14.35,15.11 90 top
R2  15.75,15.11 90 top
R3  6.86,18.29 0 top
R4  21.94,15.88 180 top
R5  3.05,23.75 180 top
R6  3.05,25.27 0 top
R7  14.73,66.8 90 top
R8  13.34,66.8 90 top
R9  5.88,69.27 0 top
R10  22.22,60.98 180 top
R11  2.92,75.82 0 top
R12  2.92,74.55 180 top
R13  14.35,40.39 90 top
R14  12.95,40.39 90 top
R15  6.22,43.81 0 top
R16  22.48,35.33 180 top
R17  2.92,50.55 0 top
R18  2.92,49.15 180 top
R19  16.51,93.34 90 top
R20  15.11,92.33 90 top
R21  7.3,94.67 0 top
R22  22.6,85.87 180 top
R23  3.17,101.35 0 top
R24  3.17,100.08 180 top
U$1  21.59,75.44 180 top
U$2  21.59,24.64 180 top
U$3  21.59,50.04 180 top
U$4  21.59,100.84 180 top
U$5  6.35,2.79 90 top
U$6  29.84,7.75 90 top
X1  16.89,6.35 90 top

### Tracks (layer width: path | path; a pad name or v marks a point on that pad's centre or on a via)
GND  (via drill 0.6)
  Top 0.152: R7.1 R8.1 C4.1 v11.94,64.9 | IC4.EP 11.68,93.18 IC4.5 10.41,93.18 v10.41,90.59 | R23.1 2.54,101.35 v2.54,102.74 | C11.1 19.43,92.9 v19.43,90.93 | IC1.EP 9.65,67.78 IC1.5 8.65,66.98 v9.65,66.98 | C5.1 v17.4,65.41 | R11.1 2.29,76.58 v2.29,77.85 | IC3.EP 9.27,41.87 | 9.27,41.87 IC3.5 | 9.27,41.87 v9.27,40.89 | v10.34,39.75 10.54,39.74 C7.1 R14.1 R13.1 | C9.1 v2.92,40.51 | C8.1 v16.64,39.45 | R17.1 2.29,51.31 v2.29,52.32 | C2.1 18.67,14.84 v18.67,14.28 | R2.1 R1.1 C3.1 11.81,14.46 v11.81,14.48 | IC2.5 10.41,16.22 IC2.EP v10.41,15.32 | C1.1 v4.19,14.99 | R6.1 2.4,26.42 v2.41,26.42 | C6.1 v4.2,64.9
  Top 0.254: C12.1 v4.95,90.93 | R19.1 16.51,91.17 15.11,91.17 | R20.1 15.11,91.17 | v12.5,91.2 12.7,91.17 C10.1 15.11,91.17
  Top 0.406: v35.43,13.46 35.45,13.46 U$6.1_1 U$6.1 | X1.5 18.49,10.54 v19.68,10.54 | U$5.1 5.05,7.24 v3.81,7.24
  pour Bottom (no thermals): 1.27,1.27 38.1,1.27 38.1,107.95 1.27,107.95
N$1
  Top 0.152: IC1.6 11.94,67.78 C4.2
N$2
  Top 0.152: IC1.7 13.34,68.18 R8.2
N$3
  Top 0.152: IC1.8 14.73,68.58 R7.2
N$4  (via drill 0.6)
  Top 0.152: IC1.3 6.3,68.58 v6.3,67.2 | v6.3,61.8 6.3,60.98 R10.2
  Bottom 0.152: v6.3,67.2 v6.3,61.8
N$5
  Top 0.152: IC1.2 7.5,68.98 7.5,69.27 R9.2
N$6
  Top 0.152: R9.1 LED3.C
N$7
  Top 0.152: R10.1 LED4.C
N$8
  Top 0.152: IC3.6 11.56,41.87 C7.2
N$9
  Top 0.152: IC3.7 12.95,42.27 R14.2
N$10
  Top 0.152: IC3.8 14.35,42.67 R13.2
N$11  (via drill 0.6)
  Top 0.152: IC3.3 5.5,42.67 v5.5,42.4 | v5.5,37.1 5.5,35.33 R16.2
  Bottom 0.152: v5.5,42.4 v5.5,37.1
N$12
  Top 0.152: IC3.2 7.62,43.07 7.62,43.81 R15.2
N$13
  Top 0.152: R15.1 LED5.C
N$14
  Top 0.152: R16.1 LED6.C
N$15
  Top 0.152: IC4.6 13.72,93.18 C10.2
N$16
  Top 0.152: IC4.7 15.11,93.58 R20.2
N$17
  Top 0.152: IC2.6 12.95,16.22 C3.2
N$18
  Top 0.152: IC2.7 14.35,16.62 R1.2
N$19
  Top 0.152: IC2.8 15.75,17.02 R2.2
N$20  (via drill 0.6)
  Top 0.152: IC2.3 6.8,17.02 v6.8,16.6 | v6.8,12.1 21.29,12.1 R4.2
  Bottom 0.152: v6.8,16.6 v6.8,12.1
N$21
  Top 0.152: IC2.2 8.38,17.42 8.38,18.29 R3.2
N$22
  Top 0.152: R3.1 LED1.C
N$23
  Top 0.152: R4.1 LED2.C
N$24
  Top 0.152: IC4.8 16.51,93.98
  Top 0.254: 16.51,93.98 R19.2
N$25  (via drill 0.6)
  Top 0.152: IC4.3 9.1,93.98 9.1,93.6 6.4,93.6 v6.4,93 | v6.4,88.1 6.4,85.87 R22.2
  Bottom 0.152: v6.4,93 v6.4,88.1
N$26
  Top 0.152: IC4.2 9.1,94.38 9.1,94.7 7.95,94.7 R21.2
N$27
  Top 0.254: R21.1 LED7.C
N$28
  Top 0.254: R22.1 LED8.C
N$29
  Top 0.406: X1.1 15.29,11.05 D1.A
N$31
  Top 0.406: U$5.5 7.65,8.38 D2.A
N$32
  Top 0.406: U$6.2 U$6.3 24.25,13.84 D3.A
TS
  Top 0.152: IC2.9 16.89,17.42 16.89,12.95 1.95,12.95 1.95,21.21 3.68,21.21 3.68,23.75 R5.1 R6.2
TS2
  Top 0.152: IC1.9 15.88,68.98 15.88,63.37 1.4,63.37 1.4,71.5 3.57,71.5 R12.1 R11.2
TS3
  Top 0.152: IC3.9 15.37,43.07 15.37,38.35 1.65,38.35 1.65,45.34 3.57,45.34 R18.1 R17.2
TS4
  Top 0.152: IC4.9 13.84,94.38 13.84,95.12 17.91,95.12 17.91,89.29 2.79,89.29 2.79,97.54 3.83,97.54 R24.1 R23.2
VBAT
  Top 0.152: IC2.10 12.19,17.82 12.19,18.03
  Top 0.406: U$2.POS 5.86,20.95 12.19,20.95 | 12.19,20.95 18.67,20.95 | 18.67,20.95 24,20.95 24,17.65 JST1.1 | C2.2 18.67,20.95 | 12.19,18.03 12.19,20.95
VBAT2
  Top 0.152: IC1.10 11.3,69.38 11.3,69.72
  Top 0.406: U$1.POS 5.86,71.37 11.3,71.37 | 11.3,71.37 17.4,71.37 | 17.4,71.37 24.4,71.37 JST3.1 | C5.2 17.4,71.37 | 11.3,69.72 11.3,71.37
VBAT3
  Top 0.152: IC3.10 11.05,43.47 11.05,43.94
  Top 0.406: U$3.POS 5.86,46.23 11.05,46.23 | 11.05,46.23 16.64,46.23 | 16.64,46.23 21.72,46.23 21.72,37.34 JST2.1 | C8.2 16.64,46.23 | 11.05,43.94 11.05,46.23
VBAT4
  Top 0.152: IC4.10 13.34,94.78 13.34,95
  Top 0.406: U$4.POS 5.86,97.54 13.34,97.54 | 13.34,97.54 19.3,97.54 | 19.3,97.54 23.11,97.54 23.11,88.14 JST4.1 | C11.2 19.3,97.54 | 13.34,95 13.34,97.54
VUSB  (1 unrouted)
  Top 0.152: IC4.4 9.65,93.58 9.65,90.93 C12.2 | IC1.4 8,68.18 8,65.79 C6.2 | IC3.4 7.49,42.27 7.49,40.39 6.54,40.39 C9.2 | IC2.4 8.51,16.62 8.51,14.99 C1.2
  pour Top (no thermals): 0,0 38.1,0 38.1,109.09 0,109.09

### Text on the board
tPlace: done_4 | charging_4 | 800mA | done_3 | charging_3 | 400mA | done_2 | charging_2 | 200mA | done_1 | 100mA | charging_1
bPlace: ER Design: 5/18' / Battery Charger V1.1